# EasyEDA schematic converter_schematic.json
TITLE: Sheet_1; REV: 1.0; Date: 2023-12-14; Sheet: 1/1
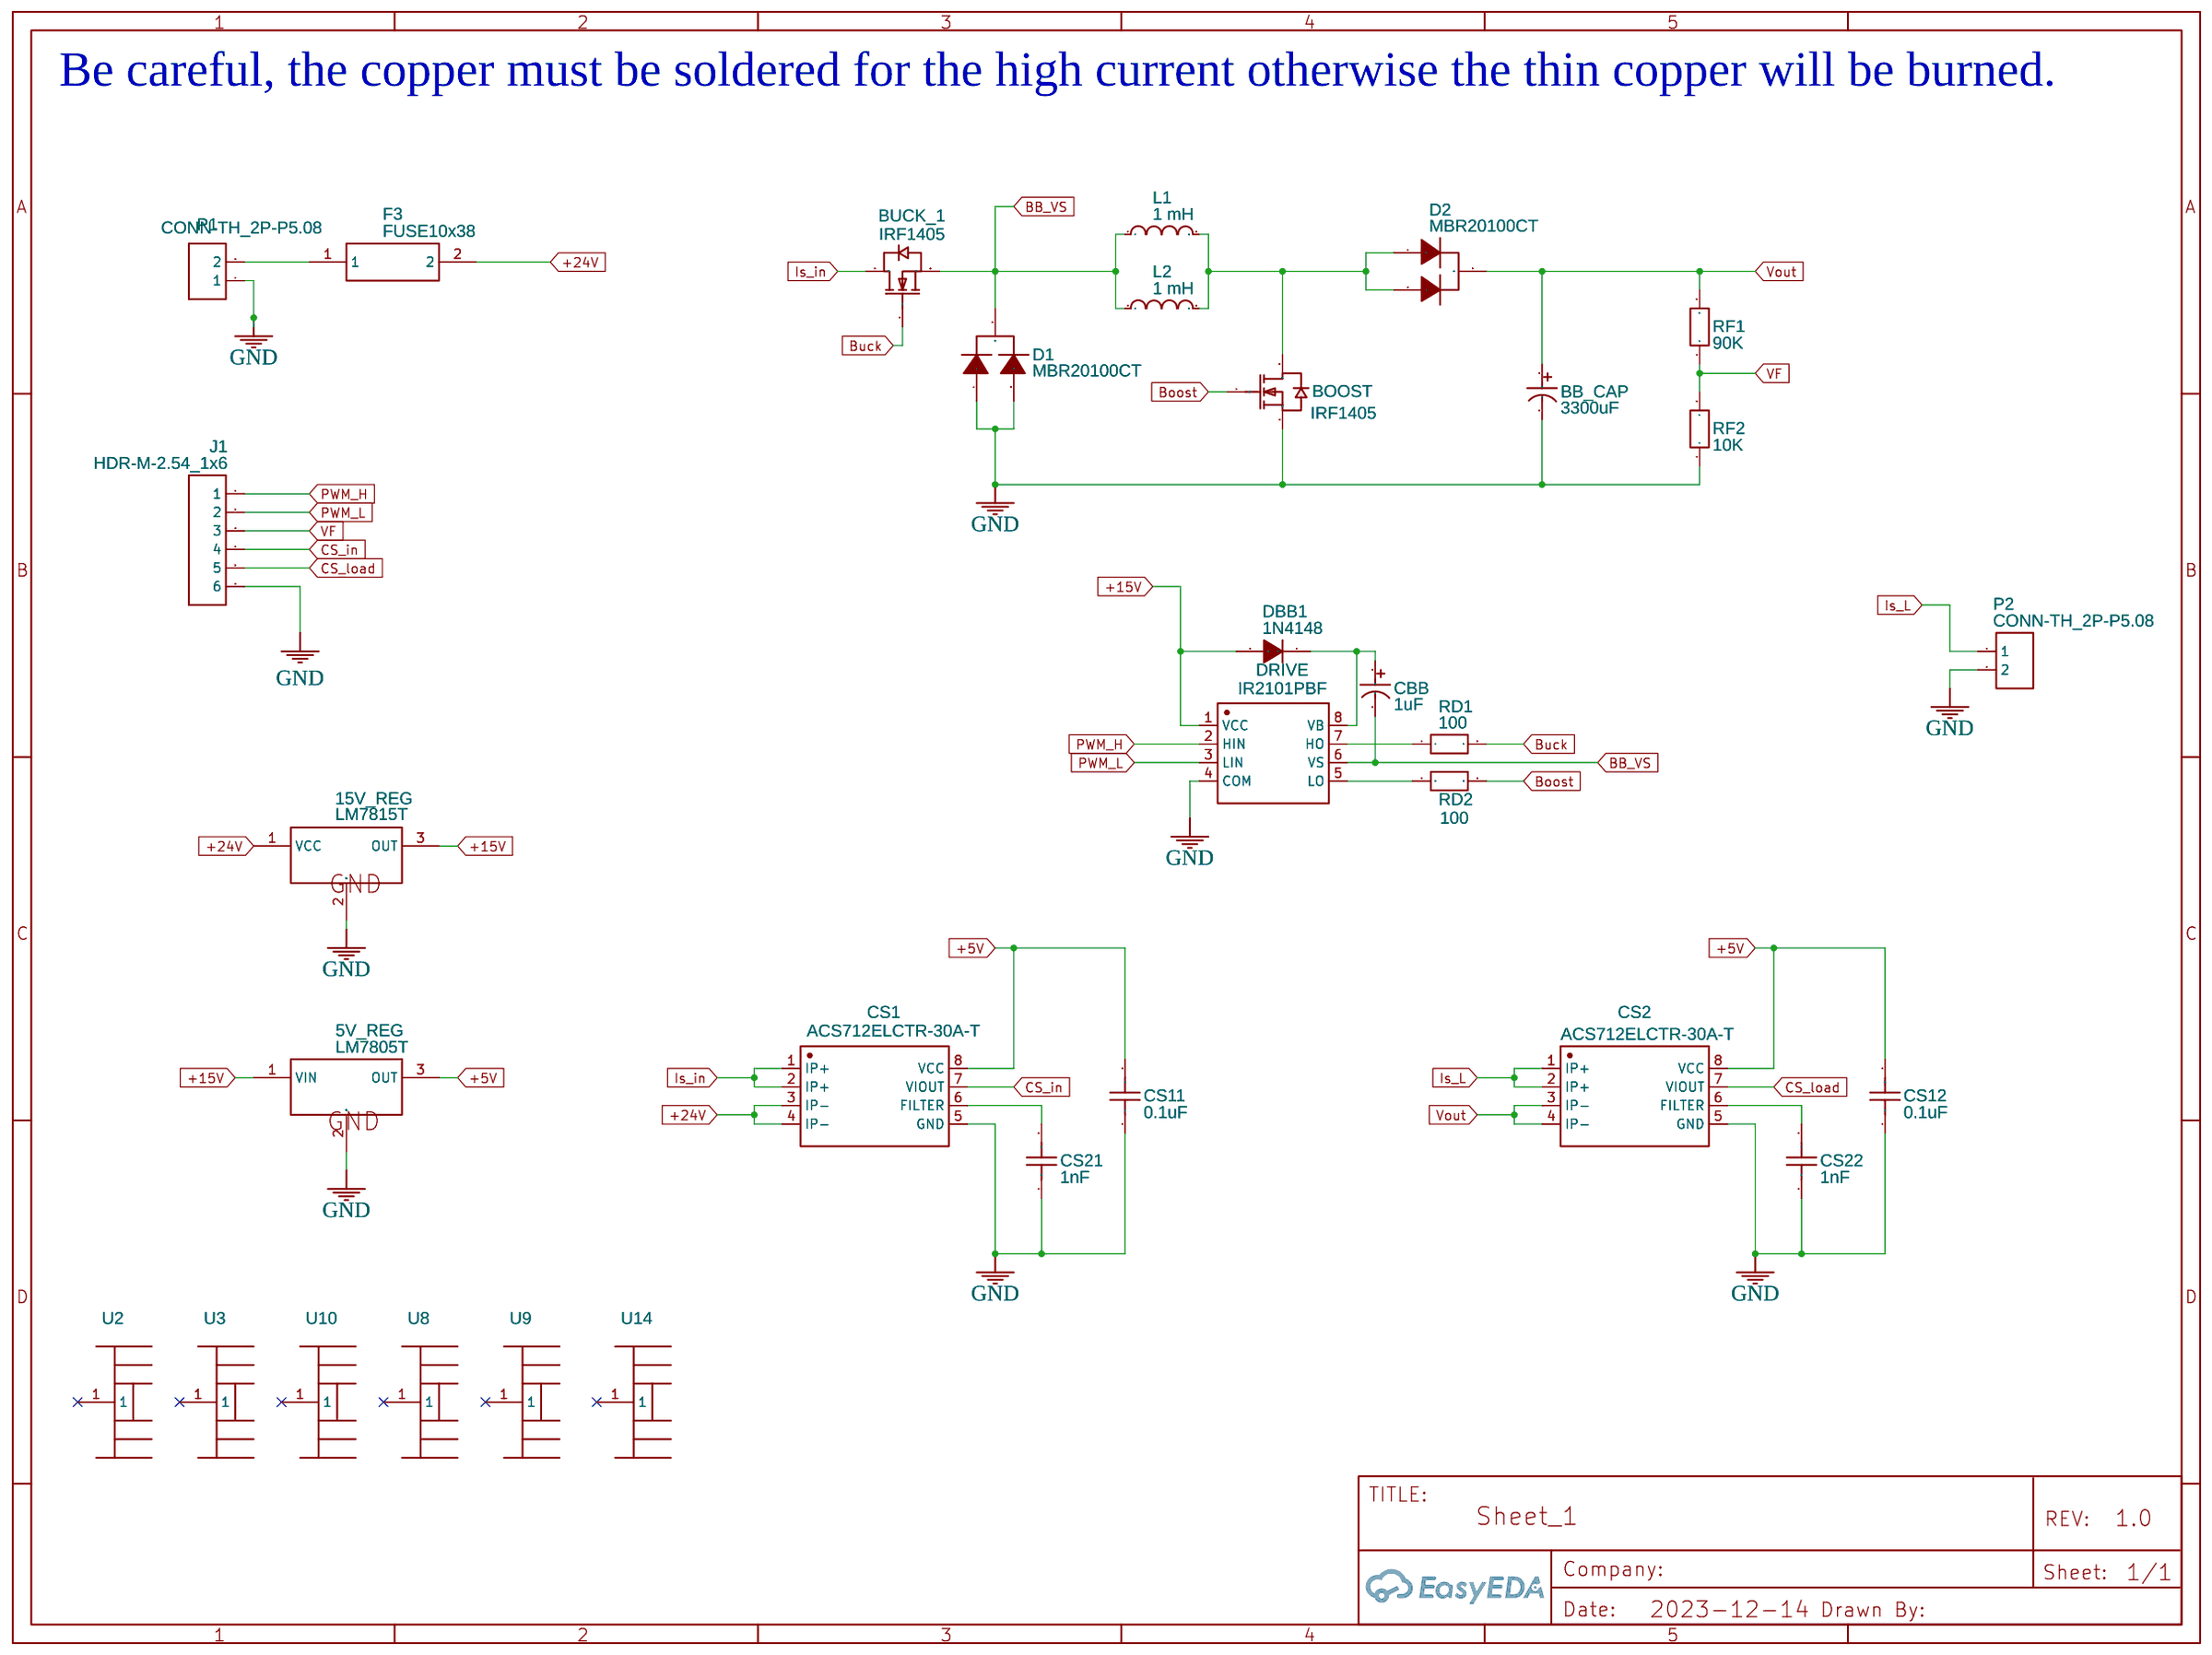
[diagram p0: schematic sheet]

## Parts
5V_REG  LM7805T  [TO-220-3_L10.0-W4.5-P2.54-L]
15V_REG  LM7815T  [TO-220-3_L10.0-W4.5-P2.54-L]
BB_CAP  3300uF  [CAP-TH_BD18.0-P7.50-D1.2-FD]
BOOST  IRF1405  [TO-220-3_L10.0-W4.5-P2.54-L]
BUCK_1  IRF1405  [TO-220-3_L10.0-W4.5-P2.54-L]
CBB  1uF  [CAP-TH_BD4.0-P1.50-D0.8-FD]
CS1  ACS712ELCTR-30A-T  [SOIC-8_L5.0-W4.0-P1.27-LS6.0-BL]
CS2  ACS712ELCTR-30A-T  [SOIC-8_L5.0-W4.0-P1.27-LS6.0-BL]
CS11  0.1uF  [RAD-0.1]
CS12  0.1uF  [RAD-0.1]
CS21  1nF  [RAD-0.1]
CS22  1nF  [RAD-0.1]
D1  MBR20100CT  [TO-220-3_L10.0-W4.5-P2.54-L]
D2  MBR20100CT  [TO-220-3_L10.0-W4.5-P2.54-L]
DBB1  1N4148  [DO-35_BD2.0-L4.2-P8.20-D0.5-RD]
DRIVE  IR2101PBF  [DIP-8_L9.9-W6.6-P2.54-LS7.62-BL]
F3  FUSE10x38  [FUSE10X38]
J1  HDR-M-2.54_1x6  [HDR-M-2.54_1X6]
L1  1 mH  [TOROIDAL_INDUCTOR_27_11_MM]
L2  1 mH  [TOROIDAL_INDUCTOR_27_11_MM]
P1  CONN-TH_2P-P5.08  [CONN-TH_2P-P5.08]
P2  CONN-TH_2P-P5.08  [CONN-TH_2P-P5.08]
RD1  100  [R_AXIAL-0.4]
RD2  100  [R_AXIAL-0.4]
RF1  90K  [R_AXIAL-0.4]
RF2  10K  [R_AXIAL-0.4]
U2  散热片15.5*10.5*24 带针  [HEATSINK-TH_L15.5-W10.5-XSD1226-005]
U3  散热片15.5*10.5*24 带针  [HEATSINK-TH_L15.5-W10.5-XSD1226-005]
U8  散热片15.5*10.5*24 带针  [HEATSINK-TH_L15.5-W10.5-XSD1226-005]
U9  散热片15.5*10.5*24 带针  [HEATSINK-TH_L15.5-W10.5-XSD1226-005]
U10  散热片15.5*10.5*24 带针  [HEATSINK-TH_L15.5-W10.5-XSD1226-005]
U14  散热片15.5*10.5*24 带针  [HEATSINK-TH_L15.5-W10.5-XSD1226-005]

## Library data of the parts
5V_REG = LM7805T: Contributor: LCSC; Supplier: LCSC; Supplier Part: C507145; Manufacturer: HGC(华冠); JLCPCB Part Class: Extended Part
15V_REG = LM7815T: Contributor: LCSC; Supplier: LCSC; Supplier Part: C507139; Manufacturer: HGSEMI(华冠); JLCPCB Part Class: Extended Part
BB_CAP = 3300UF 50V 18*36: Supplier: LCSC; Manufacturer: ValuePro; Manufacturer Part: 3300uF 50V 18*36; Supplier Part: C45658; Contributor: 立创EDA官方封装库; JLCPCB Part Class: Extended Part
BOOST BUCK_1 = IRF1405PBF-VB: Supplier: LCSC; Supplier Part: C7463487; Manufacturer: VBsemi(微碧); Contributor: lcsc
CBB = 1uF 50V 4*5: Supplier: LCSC; Manufacturer: CX(承兴); Manufacturer Part: KF105M050C05RR0VH2FP0; Supplier Part: C47848; JLCPCB Part Class: Extended Part
CS1 CS2 = ACS712ELCTR-30A-T: Supplier: LCSC; Manufacturer: ALLEGRO(美国埃戈罗); Supplier Part: C9932; JLCPCB Part Class: Extended Part
CS11 CS12 CS21 CS22 = C_RAD-0.1_US: Contributor: LCEDA_Lib
D1 D2 = MBR20100CT_C2920871: Contributor: lcsc; Supplier: LCSC; Supplier Part: C2920871; Manufacturer: minos(迈诺斯); JLCPCB Part Class: Extended Part
DBB1 = 1N4148-C85057: Supplier: LCSC; Manufacturer: 星海; Supplier Part: C85057; JLCPCB Part Class: Extended Part
DRIVE = IR2101PBF: Supplier: LCSC; Manufacturer: Infineon(英飞凌); Supplier Part: C2955; JLCPCB Part Class: Extended Part
F3 = FUSE10x38: Contributor: matteo.nicolini
J1 = HDR-M-2.54_1x6: Supplier Part: C190819; Supplier: LCSC; Contributor: LCEDA_Lib
L1 L2 = HCTI-47-10.7: Contributor: Syed.Najmus.Saqib
P1 P2 = CONN-TH_2P-P5.08: Supplier: LCSC; Contributor: LCEDA_Lib
RD1 RD2 RF1 RF2 = R_AXIAL-0.4_EU: Contributor: LCEDA_Lib
U2 U3 U8-U10 U14 = 散热片15.5*10.5*24 带针: Contributor: LCSC; Supplier: LCSC; Supplier Part: C108928; Manufacturer: XSD(鑫顺达); JLCPCB Part Class: Extended Part

## Nets
+5V: 5V_REG.3(OUT) CS1.8(VCC) CS2.8(VCC) CS11.2 CS12.2
+15V: 5V_REG.1(VIN) 15V_REG.3(OUT) DBB1.2(A) DRIVE.1(VCC)
+24V: 15V_REG.1(VCC) CS1.3(IP-) CS1.4(IP-) F3.2
GND: 5V_REG.2(GND) 15V_REG.2(GND) BB_CAP.2 BOOST.3(S) CS1.5(GND) CS2.5(GND) CS11.1 CS12.1 CS21.1 CS22.1 D1.1(A) D1.3(A) DRIVE.4(COM) J1.6 P1.1 P2.2 RF2.1
BB_VS: BUCK_1.3(S) CBB.2 D1.2(C) DRIVE.6(VS) L1.1 L2.1
Boost: BOOST.1(G) RD2.2
Buck: BUCK_1.1(G) RD1.2
CS_in: CS1.7(VIOUT) J1.4
CS_load: CS2.7(VIOUT) J1.5
Is_in: BUCK_1.2(D) CS1.1(IP+) CS1.2(IP+)
Is_L: CS2.1(IP+) CS2.2(IP+) P2.1
PWM_H: DRIVE.2(HIN) J1.1
PWM_L: DRIVE.3(LIN) J1.2
VF: J1.3 RF1.1 RF2.2
Vout: BB_CAP.1 CS2.3(IP-) CS2.4(IP-) D2.2(C) RF1.2
Net-(BOOST-2): BOOST.2(D) D2.1(A) D2.3(A) L1.2 L2.2
Net-(CBB-1): CBB.1 DBB1.1(C) DRIVE.8(VB)
Net-(CS1-6): CS1.6(FILTER) CS21.2
Net-(CS2-6): CS2.6(FILTER) CS22.2
Net-(DRIVE-5): DRIVE.5(LO) RD2.1
Net-(DRIVE-7): DRIVE.7(HO) RD1.1
Net-(F3-1): F3.1 P1.2

Not connected (* = marked no-connect by the designer): U2 1*; U3 1*; U8 1*; U9 1*; U10 1*; U14 1*

## Notes on the sheet
- Be careful, the copper must be soldered for the high current otherwise the thin copper will be burned.
